# Altium schematic sheet User_Interface.SchDoc
size A0; SheetNumber: 1; SheetTotal: 1
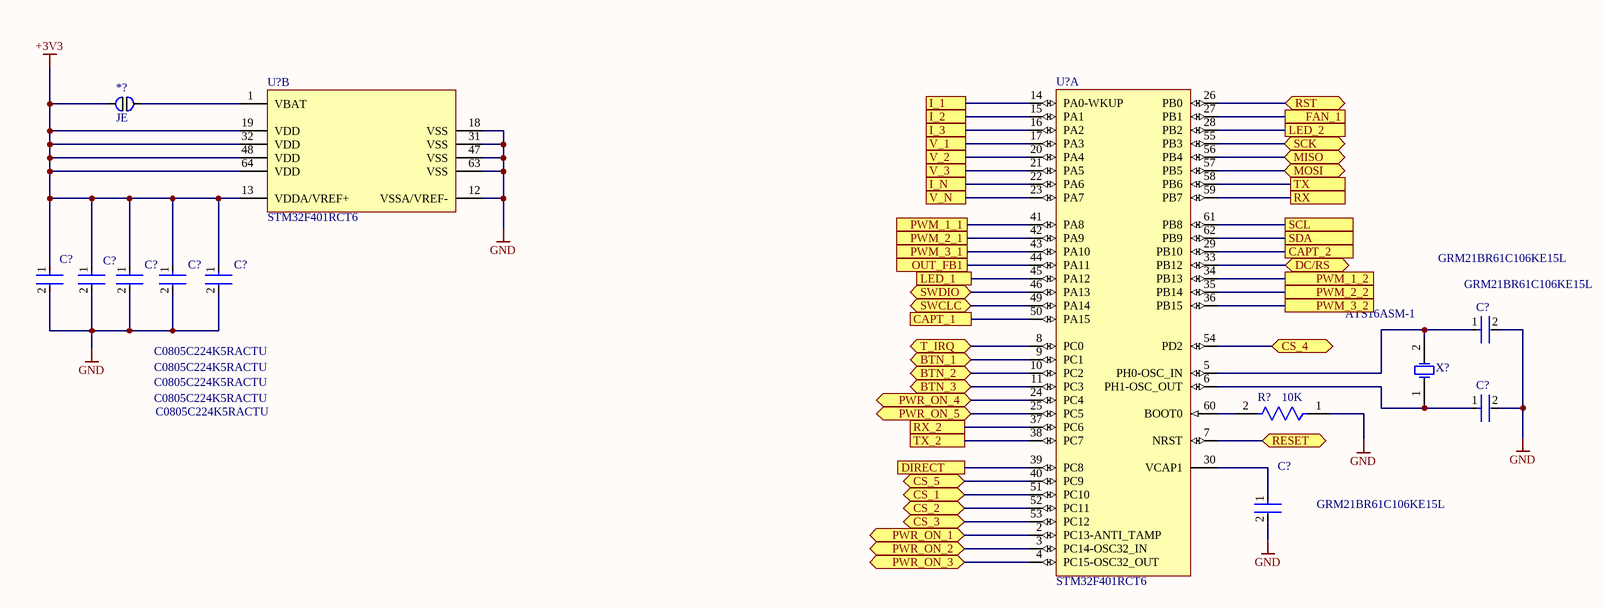
[diagram p0: User_Interface.SchDoc]

## Parts
(Parts that share a designator on the sheet are numbered #1, #2 ... from top to bottom, then left to right.)
*?  JE  [JE]
C?#1  C0805C224K5RACTU  [FP-C0805C-DN-IPC_A]
C?#2  C0805C224K5RACTU  [FP-C0805C-DN-IPC_A]
C?#3  C0805C224K5RACTU  [FP-C0805C-DN-IPC_A]
C?#4  C0805C224K5RACTU  [FP-C0805C-DN-IPC_A]
C?#5  C0805C224K5RACTU  [FP-C0805C-DN-IPC_A]
C?#6  GRM21BR61C106KE15L  [FP-GRM21B-0_1-IPC_C]
C?#7  GRM21BR61C106KE15L  [FP-GRM21B-0_1-IPC_C]
C?#8  GRM21BR61C106KE15L  [FP-GRM21B-0_1-IPC_C]
R?  10K  [Vishay_CRCW0805-e3_IPC_A]
U?#1  STM32F401RCT6  [STM-LQFP64_M]  (part A of 2)
U?#2  STM32F401RCT6  [STM-LQFP64_M]  (part B of 2)
X?  ATS16ASM-1  [CTS-ATS-SM-XTAL-2]

## Ports
BTN_1 (bidir), BTN_2 (bidir), BTN_3 (bidir), CAPT_1, CAPT_2, CS_1 (bidir), CS_2 (bidir), CS_3 (bidir), CS_4 (bidir), CS_5 (bidir), DC/RS (bidir), DIRECT, FAN_1, I_1, I_2, I_3, I_N, LED_1, LED_2, MISO (bidir), MOSI (bidir), OUT_FB1, PWM_1_1, PWM_1_2, PWM_2_1, PWM_2_2, PWM_3_1, PWM_3_2, PWR_ON_1 (bidir), PWR_ON_2 (bidir), PWR_ON_3 (bidir), PWR_ON_4 (bidir), PWR_ON_5 (bidir), RESET (bidir), RST (bidir), RX, RX_2, SCK (bidir), SCL, SDA, SWCLC (bidir), SWDIO (bidir), T_IRQ (bidir), TX, TX_2, V_1, V_2, V_3, V_N

## Nets
+3V3: *?.1 C?#1.1 C?#2.1 C?#3.1 C?#4.1 C?#5.1 U?#2.13(VDDA/VREF+) U?#2.19(VDD) U?#2.32(VDD) U?#2.48(VDD) U?#2.64(VDD)
GND: C?#1.2 C?#2.2 C?#3.2 C?#4.2 C?#5.2 C?#6.2 C?#7.2 C?#8.2 R?.1 U?#2.12(VSSA/VREF-) U?#2.18(VSS) U?#2.31(VSS) U?#2.47(VSS) U?#2.63(VSS)
BTN_1: U?#1.9(PC1) ; port BTN_1
BTN_2: U?#1.10(PC2) ; port BTN_2
BTN_3: U?#1.11(PC3) ; port BTN_3
CAPT_1: U?#1.50(PA15) ; port CAPT_1
CAPT_2: U?#1.29(PB10) ; port CAPT_2
CS_1: U?#1.51(PC10) ; port CS_1
CS_2: U?#1.52(PC11) ; port CS_2
CS_3: U?#1.53(PC12) ; port CS_3
CS_4: U?#1.54(PD2) ; port CS_4
CS_5: U?#1.40(PC9) ; port CS_5
DC/RS: U?#1.33(PB12) ; port DC/RS
DIRECT: U?#1.39(PC8) ; port DIRECT
FAN_1: U?#1.27(PB1) ; port FAN_1
I_1: U?#1.14(PA0-WKUP) ; port I_1
I_2: U?#1.15(PA1) ; port I_2
I_3: U?#1.16(PA2) ; port I_3
I_N: U?#1.22(PA6) ; port I_N
LED_1: U?#1.45(PA12) ; port LED_1
LED_2: U?#1.28(PB2) ; port LED_2
MISO: U?#1.56(PB4) ; port MISO
MOSI: U?#1.57(PB5) ; port MOSI
OUT_FB1: U?#1.44(PA11) ; port OUT_FB1
PWM_1_1: U?#1.41(PA8) ; port PWM_1_1
PWM_1_2: U?#1.34(PB13) ; port PWM_1_2
PWM_2_1: U?#1.42(PA9) ; port PWM_2_1
PWM_2_2: U?#1.35(PB14) ; port PWM_2_2
PWM_3_1: U?#1.43(PA10) ; port PWM_3_1
PWM_3_2: U?#1.36(PB15) ; port PWM_3_2
PWR_ON_1: U?#1.2(PC13-ANTI_TAMP) ; port PWR_ON_1
PWR_ON_2: U?#1.3(PC14-OSC32_IN) ; port PWR_ON_2
PWR_ON_3: U?#1.4(PC15-OSC32_OUT) ; port PWR_ON_3
PWR_ON_4: U?#1.24(PC4) ; port PWR_ON_4
PWR_ON_5: U?#1.25(PC5) ; port PWR_ON_5
RESET: U?#1.7(NRST) ; port RESET
RST: U?#1.26(PB0) ; port RST
RX: U?#1.59(PB7) ; port RX
RX_2: U?#1.37(PC6) ; port RX_2
SCK: U?#1.55(PB3) ; port SCK
SCL: U?#1.61(PB8) ; port SCL
SDA: U?#1.62(PB9) ; port SDA
SWCLC: U?#1.49(PA14) ; port SWCLC
SWDIO: U?#1.46(PA13) ; port SWDIO
T_IRQ: U?#1.8(PC0) ; port T_IRQ
TX: U?#1.58(PB6) ; port TX
TX_2: U?#1.38(PC7) ; port TX_2
V_1: U?#1.17(PA3) ; port V_1
V_2: U?#1.20(PA4) ; port V_2
V_3: U?#1.21(PA5) ; port V_3
V_N: U?#1.23(PA7) ; port V_N
Net*?_2: *?.2 U?#2.1(VBAT)
NetC?#6_1: C?#6.1 U?#1.5(PH0-OSC_IN) X?.2(X2)
NetC?#7_1: C?#7.1 U?#1.6(PH1-OSC_OUT) X?.1(X1)
NetC?#8_1: C?#8.1 U?#1.30(VCAP1)
NetR?_2: R?.2 U?#1.60(BOOT0)

## Library data of the parts
C?#1-C?#5 = CMP-1036-04552-2: CAP CER 0.22UF 50V X7R 0805; Manufacturer: KEMET; Value: 0.22 μF; Temperature Coefficient: 30ppm/°C; Material: Ceramic; Tolerance: 0.1; ComponentLink2URL: https://content.kemet.com/datasheets/KEM_C1003_C0G_SMD.pdf; Temperature Characteristic: X7R; Device Class L3: Ceramic Capacitors; Lead Free: Yes; Temperature: -55°C to +125°C; RoHS: TRUE; Capacitance: 0.22 μF; Automotive: No; Octopart: https://octopart.com/c0805c224k5ractu-kemet-144670; Manufacturer Part Number: C0805C224K5RACTU; Temperature Range Low: -55°C; Height: 0.88mm; Device Class L1: Passive Components; Digikey Description: CAP CER 0.22UF 50V X7R 0805; ComponentLink2Description: Datasheet; Mouser Description: CAP CER 0.22UF 50V X7R 0805; Category: Cap; Ipc Land Pattern Name: CAPC200125X78; Temperature Range High: +125°C; Package: C0805C-DN; Device Class L2: Capacitors; Voltage Rating: 50 V
C?#6-C?#8 = CMP-2007-03453-2: Chip Multilayer Ceramic Capacitors for General Purpose, 0805, 10uF, X5R, 15%, 10%, 16V; Radiation Hardening: No; Thickness: 0.053inch; Voltage Rating (DC): 16V; Lead Free: Lead Free; Package Quantity: 1; Width: 1.25mm; Case Code (Imperial): 0805; Depth: 1.25mm; Packaging: Tape and Reel; Dielectric: X5R; Max Operating Temperature: 85°C; Tolerance: 10%; Voltage Rating: 16V; Voltage: 16V; Capacitance: 10uF; Height: 1.25mm; Case Code (Metric): 2012; Material: Ceramic; Mount: Surface Mount; Case/Package: 0805; REACH SVHC: No SVHC; Length: 2mm; Min Operating Temperature: -55°C; Termination: SMD/SMT
R? = CRCW08050000Z0EA
U?#1 U?#2 = CMP-0243-00091-2: ARM Cortex-M4 32-bit MCU+FPU, 105 DMIPS, 256 kB Flash, 64 kB Internal RAM, 48 I/Os, 64-pin LQFP, -40 to 85 degC, Tray; Manufacturer: STMicroelectronics; Internal RAM Size (kB): 64; Supply Voltage(Vcc) max (V): 3.6; FLASH Size (Prog) (kB): 256; I/Os (High Current): 48; Operating Frequency(F) (Processor speed) (MHz): 84; Supply Voltage(Vcc) min (V): 1.8; DatasheetVersion: Rev. 1; ComponentLink1URL: http://www.st.com/web/en/home.html; ComponentLink1Description: Manufacturer URL; PackageDescription: 64-Pin Low Profile Quad Flat Package, 10 x 10 mm Body, 0.5 mm Pitch; Packing: Tray; ComponentLink3URL: http://www.st.com/st-web-ui/static/active/en/resource/technical/document/datasheet/DM00037051.pdf; PackageVersion: Rev. 4, 06/2013; ComponentLink2URL: http://www.st.com/st-web-ui/static/active/en/resource/technical/document/data_brief/DM00071938.pdf; PartNumber: STM32F401RCT6; PackageReference: LQFP64; Mounting Technology: Surface Mount; ComponentLink2Description: Datasheet; ComponentLink3Description: Package Specification; Core: ARM Cortex-M4
X? = CMP-0585-00002-2: ATS-SM Series Quartz Crystal, 16 MHz, -20 to 70 degC, 11.1 x 4.83 x 4.3mm SMD, RoHS, Tape and Reel; Manufacturer: CTS Corporation; Shunt Capacitance (C0): 7.0 pF Max; Frequency: 16 MHz; Oscillation Mode: Fundamental or 3rd Overtone; Crystal Cut: AT-Cut; ESR Maximum: 40 Ohms; Drive Level (Type): 100 uW; PackageDescription: 2-Pin SMD, Body 11.1 x 4.83 mm, Pitch 8.5 mm; PackageReference: ATS-SM-XTAL-2; ComponentLink1URL: http://www.ctscorp.com/; PartNumber: ATS16ASM-1; RoHS: TRUE; ComponentLink1Description: Manufacturer URL; Operating Temperature: -20 to 70 degC; DatasheetVersion: Rev. K; ComponentLink2Description: Datasheet; Packing: Tape and Reel; ComponentLink2URL: http://www.ctscorp.com/components/Datasheets/008-0309-0.pdf; Mounting Technology: Surface Mount; ComponentLink3URL: http://www.ctscorp.com/components/Datasheets/008-0309-0.pdf; ComponentLink3Description: Package Specification